# EAGLE schematic CanSat Schaltplan (EAGLE 9.6.2)
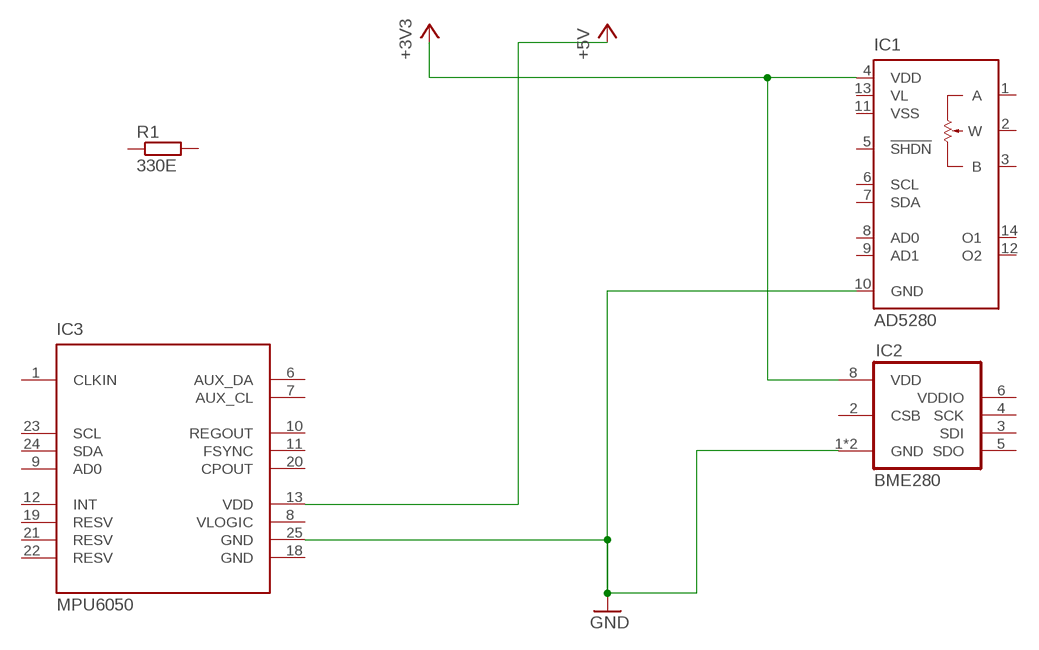
[diagram p0: schematic, sheet 1]

## Parts
IC1  AD5280  [TSSOP14]
IC2  BME280  [BME280]
IC3  MPU6050  [QFN50P400X400X95-25T265X275N]
R1  330E  R-EU_0204/5  [0204/5]

## Nets
+3V3: IC1.4(VDD) IC2.8(VDD)
+5V: IC3.13(VDD)
GND: IC1.10(GND) IC2.1(GND) IC2.7(GND) IC3.25(GND)
Unconnected: IC1.1(A) IC1.2(W) IC1.3(B) IC1.5(!SHDN) IC1.6(SCL) IC1.7(SDA) IC1.8(AD0) IC1.9(AD1) IC1.12(O2) IC1.14(O1) IC2.2(CSB) IC2.3(SDI) IC2.4(SCK) IC2.5(SDO) IC3.1(CLKIN) IC3.2(NC) IC3.3(NC) IC3.4(NC) IC3.5(NC) IC3.6(AUX_DA) IC3.7(AUX_CL) IC3.9(AD0) IC3.10(REGOUT) IC3.11(FSYNC) IC3.12(INT) IC3.14(NC) IC3.15(NC) IC3.16(NC) IC3.17(NC) IC3.19(RESV) IC3.20(CPOUT) IC3.21(RESV) IC3.22(RESV) IC3.23(SCL) IC3.24(SDA) R1.1 R1.2

## Power pins joined to a net without a drawn wire
GND: IC3.18(GND)
VDDIO: IC2.6(VDDIO)
VL: IC1.13(VL)
VLOGIC: IC3.8(VLOGIC)
VSS: IC1.11(VSS)

## Library data of the parts
IC1 = analog-devices:AD5280: Single +15 V/±5 V, 256-Position, I2C-Compatible Digital Potentiometer Source: http://www.analog.com/static/imported-files/data_sheets/AD5280_5282.pdf; MF: ALTERA CORPORATION; MPN: AD5280BRUZ20; OC_FARNELL: 1464325; OC_NEWARK: 59K3840
IC2 = bosch-bme280:BME280: DIGITAL HUMIDITY, PRESSURE AND TEMPERATURE SENSOR * Digital interface I²C (up to 3.4 MHz) and SPI (3 and 4 wire, up to 10 MHz)* Supply voltage VDD main supply voltage range: 1.71 V to 3.6 V*VDDIO interface voltage range: 1.2 V to 3.6 V Operating range -40…+85 °C, 0…100 % rel. humidity, 300…1100 hPa The library has been designed by Richard Magdycz <https://www.facebook.com/groups/eaglecadsoftUK>
IC3 = invensense:MPU6050: The triple-axis MEMS gyroscope
R1 = rcl:R-EU_: RESISTOR, European symbol; SPICEPREFIX: R